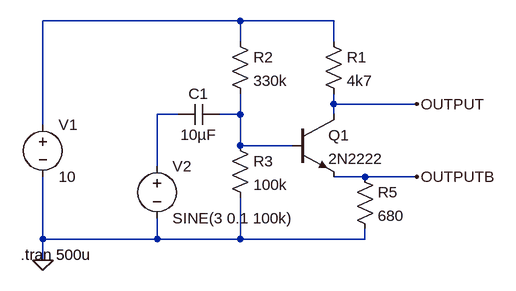
[diagram p0: schematic classA-amplifier.asc]
classA-amplifier.asc, the LTspice schematic file:
Version 4
SHEET 1 880 680
WIRE 128 -16 -176 -16
WIRE 272 -16 128 -16
WIRE 128 16 128 -16
WIRE 272 16 272 -16
WIRE 272 112 272 96
WIRE 400 112 272 112
WIRE 32 128 0 128
WIRE 128 128 128 96
WIRE 128 128 96 128
WIRE 272 128 272 112
WIRE -176 144 -176 -16
WIRE 128 176 128 128
WIRE 208 176 128 176
WIRE 0 208 0 128
WIRE 320 224 272 224
WIRE 400 224 320 224
WIRE -176 320 -176 224
WIRE 0 320 0 288
WIRE 0 320 -176 320
WIRE 128 320 128 256
WIRE 128 320 0 320
WIRE 320 320 320 304
WIRE 320 320 128 320
WIRE -176 352 -176 320
FLAG 400 112 OUTPUT
FLAG -176 352 0
FLAG 400 224 OUTPUTB
SYMBOL voltage -176 128 R0
WINDOW 123 0 0 Left 2
WINDOW 39 0 0 Left 2
SYMATTR InstName V1
SYMATTR Value 10
SYMBOL npn 208 128 R0
SYMATTR InstName Q1
SYMATTR Value 2N2222
SYMBOL res 256 0 R0
SYMATTR InstName R1
SYMATTR Value 4k7
SYMBOL voltage 0 192 R0
WINDOW 123 0 0 Left 2
WINDOW 39 0 0 Left 2
SYMATTR InstName V2
SYMATTR Value SINE(3 0.1 100k)
SYMBOL res 112 0 R0
SYMATTR InstName R2
SYMATTR Value 330k
SYMBOL res 112 160 R0
SYMATTR InstName R3
SYMATTR Value 100k
SYMBOL cap 96 112 R90
WINDOW 0 0 32 VBottom 2
WINDOW 3 32 32 VTop 2
SYMATTR InstName C1
SYMATTR Value 10µF
SYMBOL res 304 208 R0
SYMATTR InstName R5
SYMATTR Value 680
TEXT -210 344 Left 2 !.tran 500u

The netlist it stands for:
* classA-amplifier.asc
V1 N001 0 10
Q1 OUTPUT N003 OUTPUTB 0 2N2222
R1 N001 OUTPUT 4k7
V2 N002 0 SINE(3 0.1 100k)
R2 N001 N003 330k
R3 N003 0 100k
C1 N003 N002 10µF
R5 OUTPUTB 0 680
.model NPN NPN
.model PNP PNP
.lib standard.bjt
.tran 500u
.backanno
.end